# EAGLE board D-DAQ Mainboard (EAGLE 6.6.0)
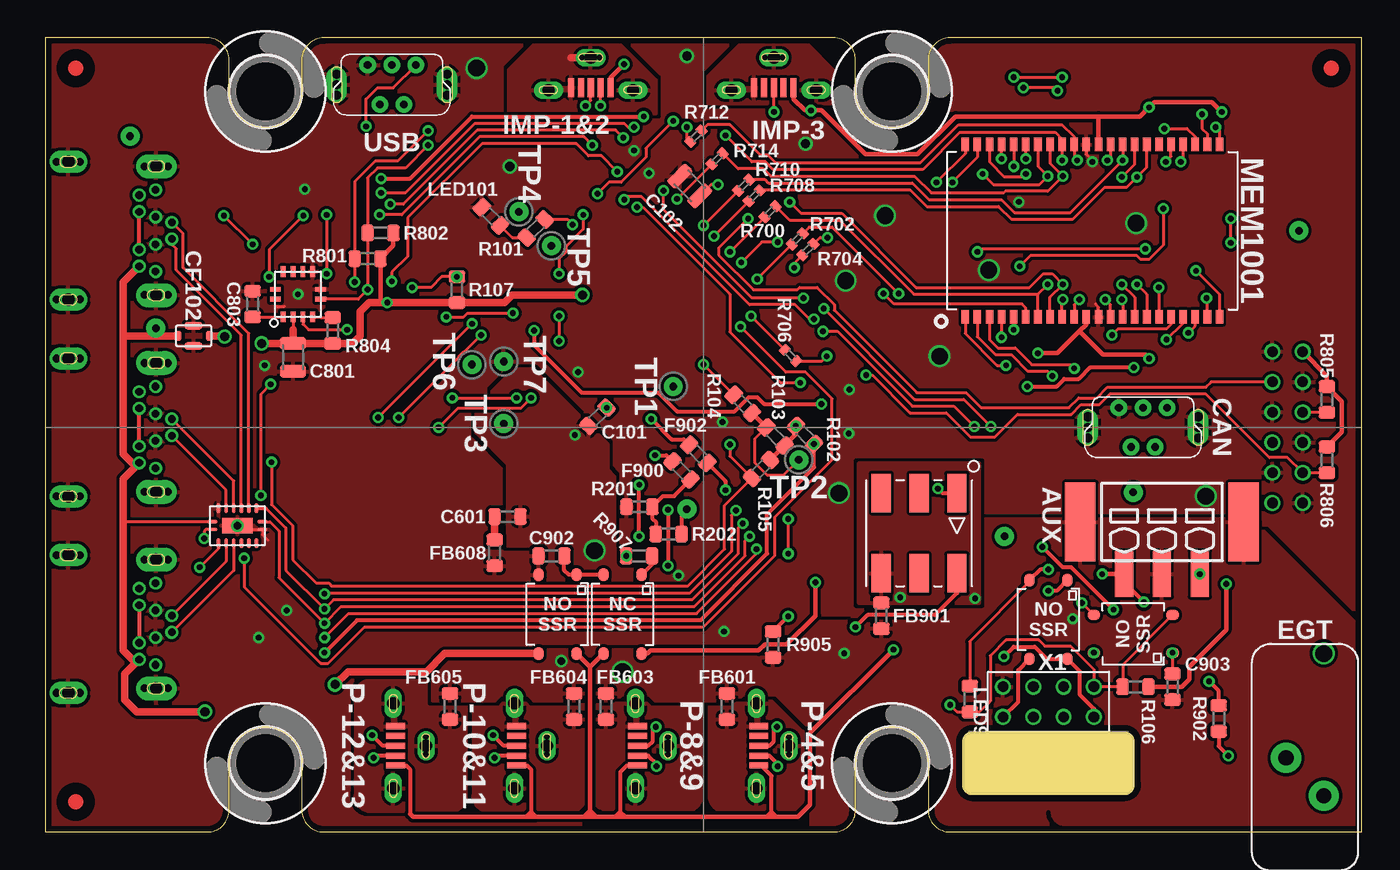
[diagram p1: board, top side]
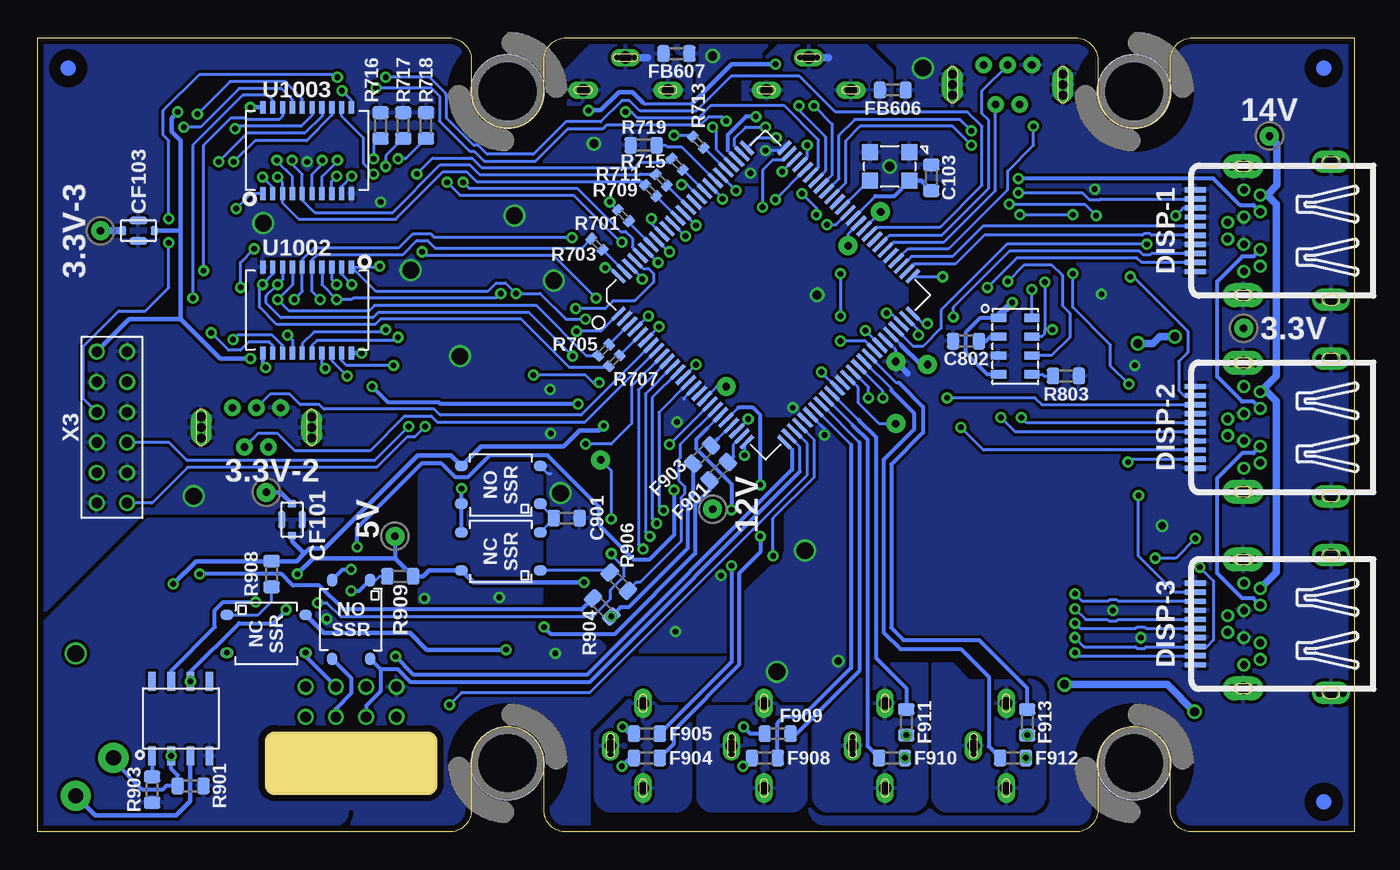
[diagram p2: board, bottom side, seen from below]

Size 87 x 52.5 mm. Coordinates in mm from the lower left corner, seen from the top.
Outline: 71.1,4.55 61.5,4.55
Outline: 0,52.5 0,0 10.7,0 arc90 12.15,1.45 12.15,4.55 arc-90 14.55,6.95 arc-90 16.95,4.55 16.95,1.45 arc90 18.4,0 52.1,0 arc90 53.55,1.45 53.55,4.55 arc-90 55.95,6.95 arc-90 58.35,4.55 58.35,1.45 arc90 59.8,0 87,0 87,52.5 59.8,52.5 arc90 58.35,51.05 58.35,48.95 arc-90 55.95,46.55 arc-90 53.55,48.95 53.55,51.05 arc90 52.1,52.5 18.4,52.5 arc90 16.95,51.05 16.95,48.95 arc-90 14.55,46.55 arc-90 12.15,48.95 12.15,51.05 arc90 10.7,52.5 0,52.5
Outline: 61.25,6 61.25,3.1 71.35,3.1 71.35,6 61.25,6
Copper layers (1*16): Top 0.0355mm / dielectric 1.53mm / Bottom 0.0355mm
Design rules "D-DAQ OSH Park 7x7 *": minimum track width 0.15mm, minimum drill 0.33mm, track to track 0.175mm, track to pad 0.175mm, pad to pad 0.175mm, via to via 0.175mm, smd to smd 0mil, copper to edge 0.4mm, drill to drill 0.15mm, minimum pad ring 0.175mm, minimum via ring 0.175mm, stop-mask expansion 0.075mm, vias tented up to drill 0mil, thermal gap 0.2mm
Net classes: 0 min: width 0.152 mm, drill 0.33 mm, clearance 0.152 mm; 1 analog: width 0.254 mm, drill 0.381 mm, clearance 0.203 mm; 2 digital: width 0.203 mm, drill 0.381 mm, clearance 0.203 mm; 3 power-low: width 0.305 mm, drill 0.381 mm, clearance 0.254 mm; 4 power-med: width 0.508 mm, drill 0.508 mm, clearance 0.254 mm; 5 power-hi: width 0.635 mm, drill 0.635 mm, clearance 0.381 mm
tRestrict: 2 lines
bRestrict: 2 lines

## Footprints (pad centres in the part's own frame; a part is rotated, then mirrored left to right if it is on the bottom)
TP-REC = drill 0.5 pad 1.25: TP 0,0
PC-1771101 = smd 1.2 x 3: P1 -2.5,-2.1; P2 0,-2.1; P3 2.5,-2.1 | smd 2 x 5.2: T0 -5.4,1.35; T1 5.4,1.35
SMD-0603 = smd 0.85 x 1.1: 1 -0.85,0; 2 0.85,0
SMD-0805 = smd 0.8 x 1.7: 1 -0.925,0; 2 0.925,0
USB-MINI-B-VERT = drill 0.5 pad 1.1: 1 1.6,1.3; 2 0.8,-1.3; 3 0,1.3; 4 -0.8,-1.3; 5 -1.6,1.3 | drill 0.6 pad 0.8: P$1 -3.65,0.7; P$2 -3.65,-0.7; P$3 3.65,0.7; P$4 3.65,-0.7 | drill 0.6 pad 1.4 long: T0 3.65,0; T1 -3.65,0
NFM21PS = smd 0.5 x 0.6: 1 -1.05,0; 3 1.05,0 | smd 1.2 x 0.5: 2@1 0,0.675; 2@2 0,-0.675
JAE-MDP-STD = smd 0.35 x 1.4: 1 2.7,6.25; 3 2.1,6.25; 5 1.5,6.25; 7 0.9,6.25; 9 0.3,6.25; 11 -0.3,6.25; 13 -0.9,6.25; 15 -1.5,6.25; 17 -2.1,6.25; 19 -2.7,6.25 | drill 0.5 pad 0.85: 2 2.7,3.042; 8 0.9,3.042; 14 -0.9,3.042 | drill 0.5 pad 0.8: 4 2.35,1.955; 6 1.25,1.955; 10 0.55,4.11; 12 -0.55,4.11; 16 -1.25,1.955; 18 -2.35,1.955; 20 -2.7,3.042 | drill 0.8 pad 1.6 long: BL 4.26,3.09; BR -4.26,3.09 | drill 0.8 pad 1.5 long: FL 4.56,-2.72; FR -4.56,-2.72 | drill 0.5 pad 0.7: P$1 -4.25,3.85; P$2 -4.25,2.3; P$3 4.25,3.85; P$4 4.25,2.3; P$5 -4.55,-1.95; P$6 -4.55,-3.5; P$7 4.55,-1.95; P$8 4.55,-3.5
PC-1702610 = drill 1 pad 2: L 1.25,1.25; R -1.25,-1.25 | drill 1.1 pad 1.4: L1 8.15,-1.25
3.2-GRMT = hole 4.8: 0,0
USB-MICRO-B-VERT = smd 0.4 x 1.25: 1 -1.3,0.9; 2 -0.65,0.9; 3 0,0.9; 4 0.65,0.9; 5 1.3,0.9 | drill 0.381 pad 0.45: P$1 -0.601,-1.1; P$2 0.601,-1.1 | drill 0.8 pad 0.9 long: T0 0,-1.1 | drill 0.8 pad 0.7 long: T1 -2.8,1.05; T2 2.8,1.05
SOP-4-NC = smd 0.7 x 0.85: 1 -1.25,-2.6; 2 1.25,-2.6; 3 1.25,2.6; 4 -1.25,2.6
SOP-4-NO = smd 0.7 x 0.85: 1 -1.25,-2.6; 2 1.25,-2.6; 3 1.25,2.6; 4 -1.25,2.6
TSOP-44 = smd 0.5 x 0.9: 1 -8.4,-5.7; 2 -7.6,-5.7; 3 -6.8,-5.7; 4 -6,-5.7; 5 -5.2,-5.7; 6 -4.4,-5.7; 7 -3.6,-5.7; 8 -2.8,-5.7; 9 -2,-5.7; 10 -1.2,-5.7; 11 -0.4,-5.7; 12 0.4,-5.7; 13 1.2,-5.7; 14 2,-5.7; 15 2.8,-5.7; 16 3.6,-5.7; 17 4.4,-5.7; 18 5.2,-5.7; 19 6,-5.7; 20 6.8,-5.7; 21 7.6,-5.7; 22 8.4,-5.7; 23 8.4,5.7; 24 7.6,5.7; 25 6.8,5.7; 26 6,5.7; 27 5.2,5.7; 28 4.4,5.7; 29 3.6,5.7; 30 2.8,5.7; 31 2,5.7; 32 1.2,5.7; 33 0.4,5.7; 34 -0.4,5.7; 35 -1.2,5.7; 36 -2,5.7; 37 -2.8,5.7; 38 -3.6,5.7; 39 -4.4,5.7; 40 -5.2,5.7; 41 -6,5.7; 42 -6.8,5.7; 43 -7.6,5.7; 44 -8.4,5.7
SMD-0402 = smd 0.55 x 0.7: 1 -0.525,0; 2 0.525,0
TQFP-100-14X14 = smd 1.15 x 0.254: 1 -7.75,6; 25 -7.75,-6; 51 7.75,-6; 75 7.75,6 | smd 1.25 x 0.254: 2 -7.7,5.5; 3 -7.7,5; 4 -7.7,4.5; 5 -7.7,4; 6 -7.7,3.5; 7 -7.7,3; 8 -7.7,2.5; 9 -7.7,2; 10 -7.7,1.5; 11 -7.7,1; 12 -7.7,0.5; 13 -7.7,0; 14 -7.7,-0.5; 15 -7.7,-1; 16 -7.7,-1.5; 17 -7.7,-2; 18 -7.7,-2.5; 19 -7.7,-3; 20 -7.7,-3.5; 21 -7.7,-4; 22 -7.7,-4.5; 23 -7.7,-5; 24 -7.7,-5.5; 52 7.7,-5.5; 53 7.7,-5; 54 7.7,-4.5; 55 7.7,-4; 56 7.7,-3.5; 57 7.7,-3; 58 7.7,-2.5; 59 7.7,-2; 60 7.7,-1.5; 61 7.7,-1; 62 7.7,-0.5; 63 7.7,0; 64 7.7,0.5; 65 7.7,1; 66 7.7,1.5; 67 7.7,2; 68 7.7,2.5; 69 7.7,3; 70 7.7,3.5; 71 7.7,4; 72 7.7,4.5; 73 7.7,5; 74 7.7,5.5 | smd 0.254 x 1.15: 26 -6,-7.75; 50 6,-7.75; 76 6,7.75; 100 -6,7.75 | smd 0.254 x 1.25: 27 -5.5,-7.7; 28 -5,-7.7; 29 -4.5,-7.7; 30 -4,-7.7; 31 -3.5,-7.7; 32 -3,-7.7; 33 -2.5,-7.7; 34 -2,-7.7; 35 -1.5,-7.7; 36 -1,-7.7; 37 -0.5,-7.7; 38 0,-7.7; 39 0.5,-7.7; 40 1,-7.7; 41 1.5,-7.7; 42 2,-7.7; 43 2.5,-7.7; 44 3,-7.7; 45 3.5,-7.7; 46 4,-7.7; 47 4.5,-7.7; 48 5,-7.7; 49 5.5,-7.7; 77 5.5,7.7; 78 5,7.7; 79 4.5,7.7; 80 4,7.7; 81 3.5,7.7; 82 3,7.7; 83 2.5,7.7; 84 2,7.7; 85 1.5,7.7; 86 1,7.7; 87 0.5,7.7; 88 0,7.7; 89 -0.5,7.7; 90 -1,7.7; 91 -1.5,7.7; 92 -2,7.7; 93 -2.5,7.7; 94 -3,7.7; 95 -3.5,7.7; 96 -4,7.7; 97 -4.5,7.7; 98 -5,7.7; 99 -5.5,7.7
TSSOP-20 = smd 0.35 x 0.85: 1 -2.925,-2.85; 2 -2.275,-2.85; 3 -1.625,-2.85; 4 -0.975,-2.85; 5 -0.325,-2.85; 6 0.325,-2.85; 7 0.975,-2.85; 8 1.625,-2.85; 9 2.275,-2.85; 10 2.925,-2.85; 11 2.925,2.85; 12 2.275,2.85; 13 1.625,2.85; 14 0.975,2.85; 15 0.325,2.85; 16 -0.325,2.85; 17 -0.975,2.85; 18 -1.625,2.85; 19 -2.275,2.85; 20 -2.925,2.85
LGA-8 = smd 1 x 0.55: 1 -1.1,1.9; 2 -1.1,0.65; 3 -1.1,-0.6; 4 -1.1,-1.85; 5 1.1,-1.85; 6 1.1,-0.6; 7 1.1,0.65; 8 1.1,1.9
LEADLESS-SMT = smd 2.54 x 1.27: 1 -2.65,2.5; 2 -2.65,0; 3 -2.65,-2.5; 4 2.65,-2.5; 5 2.65,0; 6 2.65,2.5
QFN-12 = smd 0.71 x 0.325: 1 -1.5,0.975; 2 -1.5,0.325; 3 -1.5,-0.325; 4 -1.5,-0.975; 7 1.5,-0.975; 8 1.5,-0.325; 9 1.5,0.325; 10 1.5,0.975 | smd 0.325 x 0.71: 5 -0.325,-1.5; 6 0.325,-1.5; 11 0.325,1.5; 12 -0.325,1.5
SOT-8 = smd 0.5 x 1.25: 1 -1.905,-2.465; 2 -0.635,-2.465; 3 0.635,-2.465; 4 1.905,-2.465; 5 1.905,2.465; 6 0.635,2.465; 7 -0.635,2.465; 8 -1.905,2.465
DHVQFN16 = smd 0.65 x 0.25: -CE 1.15,1.25; -Q7 -1.15,-1.25; CP -1.15,1.25; D0 1.15,-0.75; D1 1.15,-0.25; D2 1.15,0.25; D3 1.15,0.75; D4 -1.15,0.75; D5 -1.15,0.25; D6 -1.15,-0.25; D7 -1.15,-0.75; DS 1.15,-1.25 | smd 0.25 x 0.65: -PL -0.25,1.65; GND -0.25,-1.65; Q7 0.25,-1.65; VCC 0.25,1.65 | smd 1 x 2: GND2 0,0
MOLEX-87760-0816 = drill 0.7: 1 -3,-1; 2 -1,-1; 3 1,-1; 4 3,-1; 5 3,1; 6 1,1; 7 -1,1; 8 -3,1
MOLEX-87760-1216 = drill 0.7: 1 -5,-1; 2 -3,-1; 3 -1,-1; 4 1,-1; 5 3,-1; 6 5,-1; 7 5,1; 8 3,1; 9 1,1; 10 -1,1; 11 -3,1; 12 -5,1
3.2X2.5MM = smd 1.05 x 1.05: P$1 -1.3,-0.95; P$2 1.3,-0.95; P$3 1.3,0.95; P$4 -1.3,0.95

## Placement (x,y rotation side)
3.3V  TP-0463  [TP-REC]  7.3,33.3 0 bottom
3.3V-2  TP-0463  [TP-REC]  71.9,22.45 0 bottom
3.3V-3  TP-0463  [TP-REC]  82.85,39.75 0 bottom
5V  TP-0463  [TP-REC]  63.4,19.55 0 bottom
12V  TP-0463  [TP-REC]  42.4,21.35 0 bottom
14V  TP-0463  [TP-REC]  5.6,46 0 bottom
AUX  PC-3-1771101  [PC-1771101]  73.8,19.15 0 top
BFID-1  [1MM-FIDUCIAL]  2,2 0 bottom
BFID-2  [1MM-FIDUCIAL]  2,50.5 0 bottom
BFID-3  [1MM-FIDUCIAL]  85,50.5 0 bottom
C101  0.1uF  [SMD-0603]  36.5,27.45 225 top
C102  10uF  [SMD-0805]  42.6,42.7 135 top
C103  10nF  [SMD-0603]  27.95,43.25 90 bottom
C601  0.1uF  [SMD-0603]  30.55,20.85 180 top
C801  10uF  [SMD-0805]  16.38,31.38 270 top
C802  0.1uF  [SMD-0603]  25.65,32.45 0 bottom
C803  0.1uF  [SMD-0603]  13.7,34.9 90 top
C901  4.7uF  [SMD-0603]  52.05,20.75 180 bottom
C902  4.7uF  [SMD-0603]  33.45,18.25 0 top
C903  4.7uF  [SMD-0603]  74.5,9.6 270 top
CAN  UE25BE5510H  [USB-MINI-B-VERT]  72.55,26.75 0 top
CF101  [NFM21PS]  70.2,20.65 270 bottom
CF102  [NFM21PS]  9.8,32.8 0 top
CF103  [NFM21PS]  80.35,39.75 0 bottom
DISP-1  Standard  [JAE-MDP-STD]  4.25,39.75 90 bottom
DISP-2  Standard  [JAE-MDP-STD]  4.25,26.75 90 bottom
DISP-3  Standard  [JAE-MDP-STD]  4.25,13.75 90 bottom
EGT  [PC-1702610]  83.25,3.65 90 top
F900  470  [SMD-0603]  42.05,23.9 135 top
F901  470  [SMD-0603]  42,23.85 45 bottom
F902  470  [SMD-0603]  43.15,25 135 top
F903  470  [SMD-0603]  43.1,24.95 45 bottom
F904  470  [SMD-0603]  46.75,4.9 180 bottom
F905  470  [SMD-0603]  46.75,6.5 180 bottom
F908  470  [SMD-0603]  38.95,4.9 0 bottom
F909  470  [SMD-0603]  38.1,6.5 0 bottom
F910  470  [SMD-0603]  30.55,4.9 180 bottom
F911  470  [SMD-0603]  29.6,7.25 90 bottom
F912  470  [SMD-0603]  22.55,4.9 180 bottom
F913  470  [SMD-0603]  21.6,7.25 90 bottom
FB601  470  [SMD-0603]  45.05,8.3 90 top
FB603  470  [SMD-0603]  37.05,8.3 90 top
FB604  470  [SMD-0603]  34.95,8.3 90 top
FB605  470  [SMD-0603]  26.75,8.3 90 top
FB606  470  [SMD-0603]  30.5,49.05 0 bottom
FB607  470  [SMD-0603]  44.8,51.45 0 bottom
FB608  470  [SMD-0603]  29.7,18.45 90 top
FB901  470  [SMD-0603]  55.25,14.3 270 top
HOLE-BL  [3.2-GRMT]  14.55,48.95 0 top
HOLE-BR  [3.2-GRMT]  14.55,4.55 0 top
HOLE-ML  [3.2-GRMT]  55.95,48.95 0 top
HOLE-MR  [3.2-GRMT]  55.95,4.55 0 top
IMP-1&2  Micro USB  [USB-MICRO-B-VERT]  36.05,50.1 180 top
IMP-3  Micro USB  [USB-MICRO-B-VERT]  48.15,50.1 180 top
K1001  NC SSR  [SOP-4-NC]  56.4,18.55 90 bottom
K1002  NO SSR  [SOP-4-NO]  56.4,22.95 90 bottom
K1003  NC SSR  [SOP-4-NC]  38.15,14.4 180 top
K1004  NO SSR  [SOP-4-NO]  33.85,14.4 180 top
K1005  NC SSR  [SOP-4-NC]  71.9,13.1 270 bottom
K1006  NO SSR  [SOP-4-NO]  71.9,13.1 90 top
K1007  NO SSR  [SOP-4-NO]  66.3,14.05 180 top
K1008  NO SSR  [SOP-4-NO]  66.3,14.05 180 bottom
LED101  Yellow  [SMD-0603]  29.45,40.7 135 top
LED901  Red  [SMD-0603]  61.1,8.8 270 top
MEM1001  IS61WV25616ALL  [TSOP-44]  69.2,39.75 0 top
OSHW-BOT  [OSHW-LOGO-L]  6.5,4.55 90 bottom
OSHW-TOP  [OSHW-LOGO-L]  38.9,35.5 270 top
P-4&5  Micro USB  [USB-MICRO-B-VERT]  48.05,5.7 90 top
P-8&9  Micro USB  [USB-MICRO-B-VERT]  40.05,5.7 90 top
P-10&11  Micro USB  [USB-MICRO-B-VERT]  32.05,5.7 90 top
P-12&13  Micro USB  [USB-MICRO-B-VERT]  24.05,5.7 90 top
R101  10k  [SMD-0603]  32.4,39.9 225 top
R102  10k  [SMD-0603]  50.2,26.25 315 top
R103  10k  [SMD-0603]  48.25,26.15 135 top
R104  470  [SMD-0603]  46.1,28.3 135 top
R105  10k  [SMD-0603]  47.3,24 225 top
R106  10k  [SMD-0603]  72.05,9.6 180 top
R107  10k  [SMD-0603]  27.2,35.85 270 top
R201  1.4k  [SMD-0603]  39.26,21.5 0 top
R202  10k  [SMD-0603]  41.2,19.7 180 top
R700  140  [SMD-0402]  47.9,41 45 top
R701  140  [SMD-0402]  48.3,40.75 135 bottom
R702  140  [SMD-0402]  49.7,39.2 45 top
R703  140  [SMD-0402]  50.05,38.85 135 bottom
R704  140  [SMD-0402]  50.4,38.5 45 top
R705  140  [SMD-0402]  49.6,31.85 225 bottom
R706  140  [SMD-0402]  49.25,31.5 315 top
R707  140  [SMD-0402]  48.9,31.15 225 bottom
R708  140  [SMD-0402]  46.85,42.05 45 top
R709  140  [SMD-0402]  46.5,42.4 135 bottom
R710  140  [SMD-0402]  46.15,42.75 45 top
R711  140  [SMD-0402]  45.8,43.1 135 bottom
R712  140  [SMD-0402]  43,46 45 top
R713  140  [SMD-0402]  43.35,45.6 135 bottom
R714  140  [SMD-0402]  44.4,44.5 45 top
R715  140  [SMD-0402]  44.75,44.15 135 bottom
R716  10k  [SMD-0603]  64.35,46.7 90 bottom
R717  10k  [SMD-0603]  62.85,46.7 90 bottom
R718  10k  [SMD-0603]  61.35,46.7 90 bottom
R719  10k  [SMD-0603]  46.96,45.4 180 bottom
R801  1.4k  [SMD-0603]  21.3,37.9 180 top
R802  1.4k  [SMD-0603]  22.15,39.6 180 top
R803  10k  [SMD-0603]  19.05,30.15 180 bottom
R804  10k  [SMD-0603]  19,33.15 90 top
R805  10k  [SMD-0603]  84.7,28.6 270 top
R806  10k  [SMD-0603]  84.7,24.6 270 top
R901  1.4k  [SMD-0603]  76.9,3.05 180 bottom
R902  100k  [SMD-0603]  77.55,7.5 90 top
R903  10k  [SMD-0603]  79.45,2.8 270 bottom
R904  255  [SMD-0603]  49.7,14.85 315 bottom
R905  10k  [SMD-0603]  48.1,12.4 270 top
R906  100  [SMD-0603]  48.6,16.55 135 bottom
R907  100  [SMD-0603]  39.25,18.25 0 top
R908  100  [SMD-0603]  71.55,17.05 270 bottom
R909  100  [SMD-0603]  63.05,16.9 180 bottom
TFID-1  [1MM-FIDUCIAL]  2,2 0 top
TFID-2  [1MM-FIDUCIAL]  2,50.5 0 top
TFID-3  [1MM-FIDUCIAL]  85,50.5 0 top
TP1  TP-0463  [TP-REC]  41.5,29.45 0 top
TP2  TP-0463  [TP-REC]  49.8,24.6 0 top
TP3  TP-0463  [TP-REC]  30.3,27 0 top
TP4  TP-0463  [TP-REC]  31.3,41 0 top
TP5  TP-0463  [TP-REC]  33.45,38.75 0 top
TP6  TP-0463  [TP-REC]  28.2,30.9 0 top
TP7  TP-0463  [TP-REC]  30.3,31.1 0 top
U1001  795F512L-80V/PT  [TQFP-100-14X14]  38.9,35.5 45 bottom
U1002  Octal D-Latch  [TSSOP-20]  69.2,34.5 180 bottom
U1003  Octal D-Latch  [TSSOP-20]  69.2,45.05 0 bottom
U1004  Baro & Temp  [LGA-8]  22.4,32.1 0 bottom
U1005  Boost  [LEADLESS-SMT]  57.75,19.75 270 top
U1006  Accelerometer  [QFN-12]  16.7,35.55 90 top
U1007  MAX4239  [SOT-8]  77.55,7.5 0 bottom
U1008  NXP-74HC165  [DHVQFN16]  12.7,20.25 90 top
USB  UE25BE5510H  [USB-MINI-B-VERT]  22.9,49.4 0 top
X1  [MOLEX-87760-0816]  66.3,8.6 0 top
X3  MOLEX-87760-1216"  [MOLEX-87760-1216]  82.1,26.75 90 bottom
Y1001  XTC7009  [3.2X2.5MM]  30.7,44 180 bottom

## Tracks (layer width: path | path; a pad name or v marks a point on that pad's centre or on a via)
3.3V-RAIL-1
  Bottom 0.305: 3.3V-2.TP 70.95,22.45 CF101.1
3.3V-RAIL-2  (via drill 0.6)
  Top 0.203: U1008.VCC 5.15,20.5
  Top 0.508: K1004.3 26.4,11.8 25.2,10.6 20,10.6 v19.15,9.75 | DISP-1.18 5.15,36.34 5.15,32.8 | 5.15,32.8 5.15,25 5.75,24.4 DISP-2.18 5.15,23.34 5.15,20.5 5.15,12 5.75,11.4 DISP-3.18 5.25,10.45 5.25,8.75 6.05,7.95 v10.55,7.95 | 7.3,32.8 5.15,32.8 | 3.3V.TP 7.3,32.8 | CF102.1 7.3,32.8
  Bottom 0.508: v19.15,9.75 12.35,9.75 v10.55,7.95
3.3V-RAIL-3
  Bottom 0.508: 3.3V-3.TP CF103.1
5V-RAIL  (via drill 0.38)
  Top 0.254: v72.6,15.2 71.3,16.5 AUX.P1
  Top 0.305: K1003.4 39.8,11.8 40,12 47.15,12 47.55,12.4 49,12.4 50.9,14.3 v50.9,16.5 | v69.85,17.05 AUX.P1
  Bottom 0.254: U1007.7 78.19,10.66 75.3,13.55 75.3,14.65 74.75,15.2 v72.6,15.2 | 5V.TP 63.4,18.1
  Bottom 0.305: v50.9,16.5 58.2,16.5 K1001.4 61.15,17.3 61.55,16.9 R909.1 63.4,18.1 68.8,18.1 v69.85,17.05
6&7-PIN-1  (via drill 0.38)
  Bottom 0.254: X1.6 69.3,11.6 K1006.4
  other vias: 69.3,11.85
12V-INPUT
  Top 0.254: 12V.TP 42.05,21 R202.1
14V-RAIL
  Bottom 0.508: 5.75,42.1 5.15,41.5 5.15,30.16 DISP-2.4 5.75,29.1 5.15,28.5 5.15,17.16 DISP-3.4 | 14V.TP 5.1,45.5 5.1,42.75 5.75,42.1 | DISP-1.4 5.75,42.1
ACCEL-BYP
  Top 0.203: C803.1 U1006.1
ACCEL-EN
  Top 0.203: U1006.4 18.15,34.05 18.2,34 R804.2
ADT-1
  Bottom 0.203: R906.2 49.35,17.3 K1001.1
ADT-2
  Top 0.203: 40.1,17.7 R907.2
  Top 0.254: K1003.1 40.1,17.7
ADT-3
  Bottom 0.203: K1005.1 72.45,14.35 71.55,15.25 R908.2
ADT-4  (via drill 0.38)
  Top 0.254: K1007.1 66.85,15.95 v66.3,15.95
  Bottom 0.203: K1008.1 64.65,16.65 64.4,16.9 R909.2
  Bottom 0.254: v66.3,15.95 65.75,15.95 K1008.1
AGND  (via drill 0.38, 0.5, 1.1)
  Bottom 0.203: U1001.31 35,26.65 v35,26.25
  other vias: 38.15,10.6 36.3,18.6 34.1,11.3 67.9,14.1 52.8,11.8
  pour Bottom (rank 3): 32.7,12 32.7,11.4 26.9,11.4 25.6,10.1 25.6,8.7 29.7,8.7 30.1,9.1 31.9,9.1 32.3,8.7 37.7,8.7 38.1,9.1 39.9,9.1 40.3,8.7 45.7,8.7 46.1,9.1 48.3,9.1 50.6,6.8 50.6,0.5 86.5,0.5 86.5,13.9 79.75,20.65 62.1,20.65 62.1,16.9 59.1,13.9 51.2,13.9 48.8,11.5 40.3,11.5 40.3,12
  pour Bottom (rank 3): 33.7,25.35 35.5,27.2 35.5,26.3 35.3,26.1 35.3,23.25 37.6,20.95 37.6,18.45 39.15,16.9 40.2,15.9 40.2,11.7 33.7,11.7
  pour Top (rank 3): 30.6,24.3 28.5,26.4 28.5,28.1 31,30.6 32.2,30.6 37.15,25.65 37.15,23.95 37.6,23.5 37.6,18.8 38.75,17.6 38.75,16.65 33.15,16.65 33.15,18.9 30.6,18.9
  pour Top (rank 3): 32.7,12 32.7,11.4 26.9,11.4 25.6,10.1 25.6,8.7 29.7,8.7 30.1,9.1 31.9,9.1 32.3,8.7 37.7,8.7 38.1,9.1 39.9,9.1 40.3,8.7 45.7,8.7 46.1,9.1 48.3,9.1 50.6,6.8 50.6,0.5 86.5,0.5 86.5,13.9 79.75,20.65 62.1,20.65 62.1,16.9 59.1,13.9 51.2,13.9 48.8,11.5 40.3,11.5 40.3,12
ALT-INT  (via drill 0.38)
  Top 0.203: v37.8,43.65 36.75,44.7 35.9,44.7 35.1,45.5 28.85,45.5 23.95,40.6 23.95,38.05 22.9,37 v22.9,36.4
  Bottom 0.203: U1004.6 20,31.5 18.8,32.7 18.8,34.3 19.3,34.8 19.3,36.8 20,37.5 21.8,37.5 v22.9,36.4 | U1001.73 37.8,43.67 v37.8,43.65
AN0-VOLT  (via drill 0.38)
  Top 0.254: v40.3,24.9 41.05,24.9 F900.2
  Bottom 0.203: U1001.25 40.3,25.61 v40.3,24.9
AN1-BOOST
  Bottom 0.203: U1001.24 41.05,25.57 41.05,24.8
  Bottom 0.254: 41.05,24.8 F901.2
AN2-EGT  (via drill 0.38)
  Top 0.254: v40.05,27.3 | v40.05,27.3 41.4,25.95 42.2,25.95 F902.2
  Bottom 0.203: U1001.23 40.05,27.28 v40.05,27.3
AN3-AUX-PRESS
  Bottom 0.203: U1001.22 42.04,26 42.05,26
  Bottom 0.254: 42.05,26 F903.2
AN4  (via drill 0.38)
  Top 0.254: P-4&5.2 47.85,5.05 48.4,4.5 v48.4,4.35
  Bottom 0.254: v48.4,4.35 47.85,4.9 F904.2
AN5  (via drill 0.38)
  Top 0.254: P-4&5.3 47.85,5.7 48.15,6 48.15,6.75 v48.35,6.95
  Bottom 0.254: v48.35,6.95 47.9,6.5 F905.2
AN8  (via drill 0.38)
  Top 0.254: P-8&9.2 39.85,5.05 40.4,4.5 v40.4,4.35
  Bottom 0.254: v40.4,4.35 39.85,4.9 F908.1
AN9  (via drill 0.38)
  Top 0.254: P-8&9.3 39.85,5.7 40.15,6 40.15,6.75 v40.35,6.95
  Bottom 0.254: v40.35,6.95 39.9,6.5 F909.1
AN10  (via drill 0.38)
  Top 0.254: P-10&11.2 29.85,5.05 F910.1
  other vias: 29.7,4.9
AN11  (via drill 0.38)
  Top 0.254: P-10&11.3 30.3,5.7 F911.1
  other vias: 29.6,6.4
AN12  (via drill 0.38)
  Top 0.254: P-12&13.2 21.85,5.05 F912.1
  other vias: 21.7,4.9
AN13  (via drill 0.38)
  Top 0.254: P-12&13.3 22.3,5.7 F913.1
  other vias: 21.6,6.4
AUX-OUT  (via drill 0.38)
  Top 0.254: R905.1 | R905.1 R904.2
  Bottom 0.254: R904.2 48.5,14.85 47.95,14.85 44.05,18.75 44.05,21.9 43.7,22.25 F903.1
  other vias: 49.1,14.25
BARO-INT
  Bottom 0.203: U1004.5 20.6,30.25 20.5,30.15 R803.2
BOOST-GND  (via drill 0.38)
  other vias: 56.5,15.5 61.45,15.45
  pour Top: 53.75,24.35 53.75,15.15 61.75,15.15 61.75,24.35
  pour Bottom: 53.75,24.35 53.75,15.15 61.75,15.15 61.75,24.35
BOOST-OUT  (via drill 0.38)
  Top 0.254: U1005.6 60.25,15.8 58.8,14.35 54.35,14.35 v53.55,13.55
  Bottom 0.254: v53.55,13.55 53.1,13.1 48.85,13.1 43.55,18.4 43.55,21.65 42.6,22.6 F901.1
BOOST-PWR  (via drill 0.38)
  Top 0.254: v59,22.7 59.3,22.4 U1005.1
  Bottom 0.254: v59,22.7 K1002.4 K1001.3
BOOST-SSR
  Bottom 0.203: K1002.1 52.9,20.8 C901.2 52.9,20.7 K1001.2
BOOST-V-TOGGLE
  Bottom 0.203: U1001.19 44.55,25.61 44.55,24.75 44.65,24.65 44.65,23.25 44.25,22.85 44.25,22.35 44.5,22.1 44.5,19.2 47.2,16.5 47.45,16.5 R906.1
CAN-BUS-1
  Bottom 0.203: CAN.2 72.45,26.35 71.15,26.35 70,25.2 65.05,25.2 62.75,27.5 61,27.5 60.6,27.1 50.84,27.1 U1001.8
CAN-BUS-2
  Bottom 0.203: U1001.7 51.09,27.55 60.4,27.55 60.8,27.95 68.1,27.95 68.4,28.25 69.65,28.25 70.35,28.95 71.65,28.95 CAN.3
CLEAN-3.3V-1  (via drill 0.38)
  Top 0.305: R106.1 75.1,9.6 75.6,10.1 75.6,10.9 78.05,13.35 v78.05,16.4 | R103.1 | R102.1 49.6,26.3 R103.1 | R105.1 R103.1
  Bottom 0.305: R102.1 | R102.1 49.9,26.55 51.2,26.55 52.25,25.5 57.7,25.5 K1002.3 59.7,24.9 61.9,24.9 68.05,18.75 69.05,18.75 69.4,18.4 | 69.4,18.4 69.9,17.9 R908.1 76.55,17.9 v78.05,16.4 | CF101.3 70.2,19.2 69.4,18.4
  other vias: 49.6,26.85
CLEAN-3.3V-2  (via drill 0.38, 0.6)
  Top 0.203: U1006.2 16.38,33.23
  Top 0.305: R802.1 23,38.75 R801.1 22.15,35
  Top 0.508: v11.85,32.75 11.8,32.8 CF102.3 | v14.3,32.3 C801.1 | 16.38,33.23 C801.1 | C801.1 R804.1 20.3,32.3 20.8,32.8 20.8,34.4 21.4,35 22.15,35 v22.6,35 R107.2 30.35,35 30.85,35.5 v35.5,35.5
  Bottom 0.203: U1001.62 31.64,42.05 | U1001.46 29.95,32.21
  Bottom 0.254: 31.64,42.05 30.4,42.05 Y1001.P$4 | U1004.4 24.25,30.25 25.65,31.65 25.65,33.05 24.7,34 U1004.1
  Bottom 0.305: C103.1 28.6,43.05 Y1001.P$4 | 28.6,30.9 TP6.TP 28.65,30.9 29.95,32.2 29.95,32.21
  Bottom 0.508: v11.85,32.75 12.85,32.75 13.3,32.3 v14.3,32.3 | U1004.1 23.5,34.1 v22.6,35
  other vias: 37.1,28.05
  pour Bottom (isolate 0.203, no thermals): 47.8,34.3 41.02,27.52 36.78,27.52 29.52,34.78 29.52,36.22 35.86,42.56 41.94,42.56 47.8,36.7
CLEAN-3.3V-3  (via drill 0.38)
  Top 0.305: v65.6,31.65 66.9,31.65 68.35,33.1 | 68.35,33.1 68.8,33.55 MEM1001.11 | v77.75,47.6 77.1,48.25 73.3,48.25 v72.95,47.9 72.35,47.3 69.6,47.3 | 68.35,33.1 69.9,31.55 72.7,31.55 v72.95,31.3 | IMP-1&2.1 37.35,49.85 v38.25,50.75 | 49.45,49.55 IMP-3.1 49.45,48.45 50.2,47.7 v50.6,47.7 | v50.6,47.7 51.3,47.7 54.2,44.8 57.65,44.8 60.15,47.3 69.6,47.3 | v50.6,47.7 50.65,47.7 | MEM1001.33 69.6,47.3 | R806.1 85.7,26.45 85.7,28.45 R805.1 84.7,30.15 X3.7
  Bottom 0.203: 43.7,48.2 43.8,48.1 46.9,48.1 47,48.2
  Bottom 0.305: U1003.20 v72.95,47.9 | v77.75,47.6 78.15,47.2 78.15,46.3 77.55,45.7 77.55,39.75 | U1002.20 v65.6,31.65 | v38.25,50.75 41.15,50.75 43.7,48.2 | 47,48.2 47.7,48.9 48.6,48.9 49.8,47.7 v50.6,47.7 | v72.95,31.3 74.95,31.3 77.55,33.9 | CF103.3 77.55,39.75 | 77.55,39.75 77.55,33.9 | 77.55,33.9 80.95,33.9 X3.7
DGND  (via drill 0.38, 0.5, 0.6, 1.1)
  Top 0.203: MEM1001.34 68.8,44.8 69.2,44.4 v69.2,44.3 | 15.3,34.75 15.8,34.75 | 14.7,19.3 14.35,19.65 U1008.GND 12.95,20 U1008.GND2 | MEM1001.12 69.6,34.7 69.4,34.9
  Bottom 0.203: TP7.TP 30.3,31.85 U1001.45 | K1002.2 53.3,23.7 53.1,23.7 | U1001.15 44.3,28.69 44.3,28.6 | U1001.36 35.2,30.39 v35.2,30.4 | U1001.75 37.84,45.05 v38.9,45.05
  Bottom 0.406: TP7.TP 29.5,30.3
  other vias: 12.7,20.25 39.9,43.55 30.7,44 28.5,50.5 72.1,40.25 55.5,40.75 52.9,36.45 59.1,31.45 76.7,22.2 44.75,27.1 42.4,51.3 50.25,45.5 16.7,35.55 14.5,30.85 52.45,22.4 15.95,14.65 14.1,12.85 64.35,41.65 62.35,37.15 41.85,16.95 44.85,13.25 17.15,42.5 53.15,29.25 53.1,26.35
  pour Bottom (rank 5): 0.5,52 86.5,52 86.5,0.5 0.5,0.5
  pour Top (rank 5): 0.5,52 86.5,52 86.5,0.5 0.5,0.5
DISP1-B1
  Bottom 0.203: U1001.52 29.07,37.55 26.35,37.55 24.45,39.45 14,39.45 13.9,39.55 13.5,39.55 13.4,39.45 DISP-1.11
DISP1-B2
  Top 0.203: U1008.D1 12.95,32.85 8.65,37.15 8.65,38.55 8.36,38.84 DISP-1.12
DISP1-B3
  Top 0.203: U1008.D0 13.45,32.95 9.1,37.3 9.1,39.56 DISP-1.10
DISP1-HPD  (via drill 0.38)
  Top 0.203: R107.1 26.2,36.7 25.5,36 v24.25,36
  Bottom 0.203: DISP-1.17 14.05,37.65 14.35,37.95 22.3,37.95 v24.25,36 | U1001.51 29.14,36.7 R107.1
  other vias: 27.2,36.7
DISP1-RS  (via drill 0.38)
  Top 0.203: v13.7,38.85 v11.8,40.75
  Bottom 0.203: U1001.47 29.14,32.1 28.5,32.1 27.3,33.3 27.3,34.5 22.95,38.85 v13.7,38.85 | DISP-1.5 11.3,41.25 v11.8,40.75
DISP2-B1  (via drill 0.38)
  Top 0.203: v23.35,27.4 27.35,31.4 27.35,31.45 27.65,31.75 27.7,31.75 v28.8,32.85
  Bottom 0.203: U1001.49 28.8,33.18 v28.8,32.85 | DISP-2.11 22.4,26.45 v23.35,27.4
DISP2-B2
  Top 0.203: U1008.D3 11.95,22.61 DISP-2.12
DISP2-B3
  Top 0.203: U1008.D2 12.45,23.21 DISP-2.10
DISP2-HPD  (via drill 0.38)
  Top 0.203: v45.25,25.61 45.25,24.85 R105.2 44.9,21.6 44.9,18.7 42.45,16.25 18.95,16.25 18.75,16.45 17.9,16.45 16.35,18 16.35,20.25 14.95,21.65 v14.95,24.45
  Bottom 0.203: DISP-2.17 14.75,24.65 v14.95,24.45 | U1001.18 v45.25,25.61
DISP2-RS  (via drill 0.38)
  Top 0.203: v26.9,28.7 v31.15,28.7
  Bottom 0.203: v31.15,28.7 31.15,29.16 U1001.40 | v26.9,28.7 21.1,28.7 20.65,28.25 DISP-2.5
DISP3-B1  (via drill 0.38)
  Top 0.203: v46.55,19.55 46.25,19.25 46.25,18.25 42.9,14.9 19.55,14.9 v18.45,13.8 15.45,16.8 15.45,19.9 14.85,20.5 U1008.Q7
  Bottom 0.203: U1001.11 46.85,28.96 46.85,19.85 v46.55,19.55 | DISP-3.11 13.75,13.45 13.85,13.55 14.35,13.55 14.45,13.45 18.1,13.45 v18.45,13.8
DISP3-B2
  Top 0.203: U1008.D5 12.45,17.29 DISP-3.12
DISP3-B3
  Top 0.203: U1008.D4 11.95,17.89 DISP-3.10
DISP3-HPD  (via drill 0.38)
  Top 0.254: v18.45,11.85 20.6,14 43.3,14 47.7,18.4 47.7,21 50.8,24.1 R102.2
  Bottom 0.203: v18.45,11.85 18.25,11.65 DISP-3.17 | U1001.9 47.75,29.48 47.75,27 49.1,25.65 R102.2
  other vias: 50.8,25.65
DISP3-RS  (via drill 0.38)
  Top 0.203: v45.65,21.25 45.35,20.95 45.35,18.55 42.6,15.8 18.5,15.8 v18.45,15.75
  Bottom 0.203: U1001.14 45.95,27.74 45.95,21.55 v45.65,21.25 | DISP-3.5 15.6,15.25 15.7,15.35 16.15,15.35 16.25,15.25 17.95,15.25 v18.45,15.75
EGT-NEG-IN  (via drill 0.38)
  Top 0.254: R902.1 77.55,5.67 U1007.2
  Bottom 0.254: EGT.L 82,4.7 80.1,2.8 78.75,2.8 78.5,3.05 R901.2 77.75,3.75 78.19,4.18 U1007.2
  other vias: 78.19,5.04
EGT-OUT  (via drill 0.38)
  Top 0.254: v44.95,22.6 44.95,23.2 F902.1 | R902.2 77.55,9.33 v76.92,9.96 | v70.6,14.7 67.8,17.5 67.25,17.5 v65.9,18.85
  Bottom 0.254: v76.92,9.96 76.92,10.59 73.7,13.8 71.45,13.8 70.6,14.65 v70.6,14.7 | v65.9,18.85 65.9,20.1 61.65,24.35 60.3,24.35 59.4,23.45 58.6,23.45 57.15,24.9 53.3,24.9 49.9,21.5 49.9,20.3 47.6,18 46.6,18 44.95,19.65 v44.95,22.6
EGT-POS-IN
  Bottom 0.305: U1007.3 76.92,2.04 77.85,1.1 83.2,1.1 EGT.R
EGT-SHDN
  Bottom 0.254: U1007.1 R903.1
GND-FILTER
  Top 0.508: C601.2 FB608.2
HB-PD  (via drill 0.38)
  Top 0.203: MEM1001.40 v64,44
  Bottom 0.203: R717.1 64,44.7 v64,44
I2C-CLK  (via drill 0.38)
  Top 0.203: v25.3,45.4 23.8,43.9 21.95,43.9 21.3,43.25 R802.2 v21.3,35.85 20.68,35.23 U1006.5
  Bottom 0.203: U1001.66 33.6,42.92 33.6,45.7 32.65,46.65 26.55,46.65 v25.3,45.4 | U1004.8 v21.3,35.85
I2C-DATA  (via drill 0.38)
  Top 0.203: v20.45,36.35 R801.2 20.45,43 21.8,44.35 23.3,44.35 v25.3,46.35 | U1006.3 17.02,33.58 17.4,33.2 v19.95,33.2
  Bottom 0.203: U1001.67 34.05,43.18 34.05,46.05 33,47.1 26.05,47.1 v25.3,46.35 | U1004.7 20.65,32.75 20.45,32.95 20.45,33.2 | v20.45,36.35 20.45,33.2 | v19.95,33.2 20.45,33.2
ICSP-DETECT  (via drill 0.38)
  Top 0.203: K1006.2 71.2,11.05 R106.2 X1.5 69.3,10.75 67.75,12.3 66.05,12.3 65.65,12.7 63.5,12.7 62.45,11.65 62.45,8.65 61.75,7.95 LED901.2 60.25,7.95 v59.8,8.4
  Bottom 0.203: U1001.28 36.15,25.68 36.15,23.6 50.55,9.2 59,9.2 v59.8,8.4
ICSP-LED  (via drill 0.38)
  Top 0.203: K1007.2 65.05,16.55 61.1,12.6 LED901.1
  Top 0.254: v66.3,17.35 65.75,17.35 K1007.2
  Bottom 0.254: 67.5,16.65 K1008.2 66.85,17.35 v66.3,17.35
ICSP-SSR  (via drill 0.38)
  Top 0.203: K1006.1 C903.1
  other vias: 74.5,11.85
IMP-1  (via drill 0.38)
  Top 0.203: v35.7,48 36.05,48.35 IMP-1&2.3
  Bottom 0.203: U1001.68 34.5,43.44 34.5,46.8 v35.7,48
IMP-2  (via drill 0.38)
  Top 0.203: v36.7,48 IMP-1&2.2
  Bottom 0.203: U1001.69 34.95,43.69 34.95,45.95 36.7,47.7 v36.7,48
IMP-3  (via drill 0.38)
  Top 0.203: v48.15,47.6 IMP-3.3
  Bottom 0.203: U1001.70 35.4,43.95 35.4,45.75 37.65,48 42.55,48 43.35,47.2 47.35,47.2 47.75,47.6 v48.15,47.6
INPUT-V-SENSE
  Top 0.254: R202.2 40.35,20.5 40.11,20.74 R201.2 40.81,22.2 41.55,22.2 F900.1
JTAG-PIN-1
  Bottom 0.203: U1001.17 42.12,29.45 TP1.TP
JTAG-PIN-2
  Bottom 0.203: U1001.38 32.8,29.4 32.8,28.4 31.4,27 TP3.TP
JTAG-PIN-3
  Bottom 0.203: U1001.60 31.3,40.98 TP4.TP
JTAG-PIN-4
  Bottom 0.203: U1001.61 33.45,39.54 TP5.TP
LB-PD  (via drill 0.38)
  Top 0.203: v64.8,44.5 MEM1001.39
  Bottom 0.203: R716.1 64.8,45.4 v64.8,44.5
LOAD-AN6
  Top 0.254: K1007.3 64.3,10.7 64.3,8.6 X1.1
LOAD-AN7
  Bottom 0.254: K1008.3 66.3,10.2 66.3,9.15 67.3,8.15 X1.3
MCLR  (via drill 0.38)
  Top 0.203: R104.2 v43.5,30.9 | v43.5,30.9
  Bottom 0.203: U1001.13 v43.5,30.9
MPL-BYP-CAP
  Bottom 0.254: U1004.2 24.05,32.75 24.35,32.45 C802.2
OE-PD  (via drill 0.38)
  Top 0.203: v63.2,44.5 MEM1001.41
  Bottom 0.203: R718.1 62.7,44.5 v63.2,44.5
OIL-PRESS-OUT  (via drill 0.38)
  Bottom 0.254: R904.1 51.05,14.7 66.8,14.7 68.4,16.3 70.15,16.3 70.9,17.05 AUX.P3
  other vias: 76.3,17.05
OSCI
  Bottom 0.203: U1001.64 32.06,43.05 Y1001.P$3
PMA-LH  (via drill 0.38)
  Top 0.203: v66.9,49 66.7,49.2 v64.65,49.2 | v41.5,47 39.7,45.2 39.7,44.6 38.05,42.95 37.25,42.95 v36.5,42.2 | v35.55,40.8 35.55,39.85 34.4,38.7 34.4,38.35 33.95,37.9 v33.95,36.9 | v33.95,34.1 v33.95,32.45
  Bottom 0.203: U1003.11 66.28,48.38 v66.9,49 | v64.65,49.2 61,49.2 60.45,48.65 60.45,47 58.45,45 58.23,45 arc45 58.09,44.94 57.5,44.35 54.1,44.35 51.95,46.5 49.65,46.5 49.4,46.75 43.2,46.75 42.65,47.3 41.8,47.3 v41.5,47 | v36.5,42.2 35.55,41.25 v35.55,40.8 | v33.95,36.9 v33.95,34.1 | U1001.43 32.31,32.45 v33.95,32.45
PMA-LL  (via drill 0.38)
  Top 0.254: v51.3,28.3 47.5,28.3 47.05,28.75 46.5,28.75 45.55,27.8 41.75,27.8 40.5,29.05 35.45,29.05 32.31,32.19 v32.31,33.15 | v64.9,29.45 66.85,29.45 67.35,29.95 68.3,29.95 69.05,30.7 v71.95,30.7
  Bottom 0.203: U1001.44 v32.31,33.15
  Bottom 0.254: v51.3,28.3 60.4,28.3 60.5,28.4 63.85,28.4 v64.9,29.45 | U1002.11 72.12,30.88 v71.95,30.7
PMD0  (via drill 0.38)
  Top 0.203: v45.25,38.35 R700.1
  Bottom 0.203: U1001.93 45.29,38.35 v45.25,38.35
PMD1
  Bottom 0.203: U1001.94 47.93,40.29 R701.1
PMD2  (via drill 0.38)
  Top 0.203: v47.05,36.55 R702.1
  Bottom 0.203: U1001.98 47.05,36.58 v47.05,36.55
PMD3
  Bottom 0.203: U1001.99 49.66,38.48 R703.1
PMD4  (via drill 0.38)
  Top 0.203: v49.5,37.3 49.5,37.6 R704.1
  Bottom 0.203: U1001.100 49.19,37.3 v49.5,37.3
PMD5
  Bottom 0.203: U1001.3 49.23,32.24 R705.1
PMD6  (via drill 0.38)
  Top 0.203: v46.65,34.1 R706.1
  Bottom 0.203: U1001.4 46.66,34.1 v46.65,34.1
PMD7
  Bottom 0.203: U1001.5 R707.1
PMD8  (via drill 0.38)
  Top 0.203: v44.2,39.4 R708.1
  Bottom 0.203: U1001.90 44.21,39.4 v44.2,39.4
PMD9
  Bottom 0.203: U1001.89 R709.1
PMD10  (via drill 0.38)
  Top 0.203: v43.5,40.1 R710.1
  Bottom 0.203: U1001.88 v43.5,40.1 | v43.5,40.1
PMD11
  Bottom 0.203: U1001.87 R711.1
PMD12  (via drill 0.38)
  Top 0.203: R712.1 42.4,45.86 v42.4,46.6
  Bottom 0.203: v42.4,46.6 42.15,46.35 42.15,45.11 U1001.79
PMD13
  Bottom 0.203: U1001.80 R713.1
PMD14  (via drill 0.38)
  Top 0.203: v41.75,41.85 R714.1
  Bottom 0.203: U1001.83 41.75,41.89 v41.75,41.85
PMD15
  Bottom 0.203: U1001.84 44.35,43.78 R715.1
PMD-0  (via drill 0.38)
  Top 0.203: MEM1001.7 65.6,35.55 | 65.6,35.55 v66.25,36.2 | R700.2 49.19,40.45 52.5,40.45 57.4,35.55 65.6,35.55
  Bottom 0.203: U1002.2 66.92,36.88 v66.25,36.2
PMD-1  (via drill 0.38)
  Top 0.203: MEM1001.8 66.4,35.35 v67.25,36.2 66.55,36.9 65.95,36.9 65.05,36 57.55,36 52.65,40.9 49.95,40.9 v49.2,41.65
  Bottom 0.203: U1002.3 67.58,36.52 v67.25,36.2 | R701.2 v49.2,41.65
PMD-2  (via drill 0.38)
  Top 0.203: MEM1001.9 67.2,35.15 v67.25,35.2 | R702.2 50.5,40 52,40 v56.4,35.6
  Bottom 0.203: U1002.4 68.22,36.17 v67.25,35.2 66.25,35.2 66.15,35.3 56.7,35.3 v56.4,35.6
PMD-3  (via drill 0.38)
  Top 0.203: MEM1001.10 68,34.85 v68.35,35.2
  Bottom 0.203: v68.35,35.2 68.88,35.73 U1002.5 68.88,37.83 68.55,38.15 62.9,38.15 61.95,39.1 61.25,39.1 60.75,38.6 51.04,38.6 R703.2
PMD-4  (via drill 0.38)
  Top 0.203: MEM1001.13 70.4,34.85 v70.05,35.2 | R704.2 51.2,39.3 v51.7,39.3
  Bottom 0.203: v70.05,35.2 69.53,35.73 U1002.6 69.53,37.83 68.75,38.6 63.15,38.6 62.2,39.55 61.05,39.55 60.8,39.3 v51.7,39.3
PMD-5  (via drill 0.38)
  Top 0.203: MEM1001.14 71.2,35.15 v71.15,35.2
  Bottom 0.203: U1002.7 70.17,36.17 v71.15,35.2 70.4,34.45 65.1,34.45 64.75,34.8 54.05,34.8 50.73,31.48 R705.2
PMD-6  (via drill 0.38)
  Top 0.203: MEM1001.15 72,35.35 v71.15,36.2 | R706.2 51.33,31.13 v51.65,31.45
  Bottom 0.203: U1002.8 70.83,36.52 v71.15,36.2 71.9,35.45 71.9,34.95 70.95,34 64.85,34 64.5,34.35 54.55,34.35 v51.65,31.45
PMD-7  (via drill 0.38)
  Top 0.203: MEM1001.16 72.8,35.55 v72.15,36.2
  Bottom 0.203: U1002.9 71.47,36.88 v72.15,36.2 72.35,36 72.35,34.7 71.2,33.55 64.7,33.55 64.35,33.9 55.05,33.9 51.9,30.75 49.3,30.75 R707.2
PMD-8  (via drill 0.38)
  Top 0.203: MEM1001.29 72.8,43.95 v72.15,43.3 71.45,42.6 70,42.6 67.9,40.5 63.85,40.5 63,41.35 58.25,41.35 57.15,42.45 47.25,42.45 R708.2
  Bottom 0.203: U1003.2 71.47,42.62 v72.15,43.3
PMD-9  (via drill 0.38)
  Top 0.203: MEM1001.30 72,44.15 v71.15,43.3
  Bottom 0.203: v71.15,43.3 70.83,42.98 U1003.3 70.83,41.58 69.75,40.5 63.35,40.5 60.2,43.65 58.65,43.65 58,43 47.1,43 R709.2
PMD-10  (via drill 0.38)
  Top 0.203: MEM1001.31 v71.2,44.4 67.75,40.95 64.05,40.95 63.2,41.8 58.4,41.8 57.3,42.9 47.8,42.9 47.55,43.15 46.55,43.15 R710.2
  Bottom 0.203: U1003.4 70.17,43.33 71.2,44.35 v71.2,44.4
PMD-11  (via drill 0.38)
  Top 0.203: MEM1001.32 70.4,44.6 v70.2,44.4
  Bottom 0.203: v70.2,44.4 70.2,44.15 69.53,43.48 U1003.5 69.53,41.77 68.7,40.95 63.55,40.95 60.4,44.1 58.45,44.1 57.8,43.45 47.25,43.45 47.2,43.5 46.2,43.5 R711.2
PMD-12  (via drill 0.38)
  Top 0.203: R712.2 43.75,46.75 45.25,46.75 47.25,44.75 47.75,44.75 48.25,44.25 57.85,44.25 60.35,46.75 67.2,46.75 68,45.95 MEM1001.35 68,44.6 v68.2,44.4
  Bottom 0.203: U1003.6 68.88,43.48 68.2,44.15 v68.2,44.4
PMD-13  (via drill 0.38)
  Top 0.203: v67.2,44.4 MEM1001.36 67.2,45.8 66.75,46.25 60.45,46.25 58,43.8 48.1,43.8 47.6,44.3 46.7,44.3 v44.95,46.05
  Bottom 0.203: U1003.7 68.22,43.33 67.2,44.35 v67.2,44.4 | v44.95,46.05 43.8,46.05 arc90 R713.2
PMD-14  (via drill 0.38)
  Top 0.203: MEM1001.37 66.4,44.2 v67.25,43.35 66.25,42.35 63.45,42.35 63.35,42.25 58.55,42.25 57.45,43.35 47.95,43.35 47.45,43.85 45.79,43.85 R714.2
  Bottom 0.203: U1003.8 67.58,43.02 v67.25,43.35
PMD-15  (via drill 0.38)
  Top 0.203: MEM1001.38 65.6,44 v66.25,43.35 65.7,42.8 62.65,42.8 v61.95,43.5
  Bottom 0.203: U1003.9 66.92,42.67 v66.25,43.35 | v61.95,43.5 60.9,44.55 58.3,44.55 57.65,43.9 47.6,43.9 47.25,44.25 45.39,44.25 R715.2
PMP-CS1  (via drill 0.38)
  Top 0.203: MEM1001.6 64.8,34.65 64.55,34.9 56.1,34.9 v55.4,35.6 | v50.8,33.9 50.5,33.9 49.55,34.85 46.55,34.85 39.4,42 38.46,42 v38.26,41.8 | v73.9,41.2 73.9,38.8 72.95,37.85 72.4,37.85 72.15,38.1 65.1,38.1 v64.4,37.4
  Bottom 0.203: v50.8,33.9 52.1,33.9 53.8,35.6 v55.4,35.6 56.1,36.3 56.7,36.3 57.25,35.75 64.67,35.75 U1002.1 64.45,37.35 v64.4,37.4 | v38.26,41.8 U1001.71 | U1003.1 72.9,42.2 v73.9,41.2
PMP-READ
  Bottom 0.203: U1001.82 44.46,45.3 45.4,45.3 45.5,45.4 R719.1
PMP-WRITE  (via drill 0.38)
  Top 0.203: v61.6,38.35 61.8,38.55 v72.7,38.55 | v73.6,36 MEM1001.17 | v50.1,35.3 46.7,35.3 40.85,41.15 v40.85,42.4
  Bottom 0.203: v61.6,38.35 61.4,38.15 52.95,38.15 v50.1,35.3 | v73.6,36 73.6,37.65 v72.7,38.55 | U1001.81 v40.85,42.4 | v40.85,42.4
PWM1-WARN  (via drill 0.38)
  Top 0.203: v38.9,46.6 38.5,46.6 38.25,46.85 28.4,46.85 23.8,42.25 v22.2,42.25
  Bottom 0.203: U1001.77 40.95,45.33 40.95,45.85 40.2,46.6 v38.9,46.6 | v22.2,42.25 17.95,42.25 17.5,41.8 16.8,41.8 16.75,41.85 DISP-1.3
PWM2-WARN  (via drill 0.38)
  Top 0.203: v38.2,45.9 37.7,46.4 28.55,46.4 23.65,41.5 v22.8,41.5 | v17.05,40.75 14.8,38.5 v14.8,36.7
  Bottom 0.203: U1001.76 39.46,45.9 v38.2,45.9 | v22.8,41.5 17.8,41.5 v17.05,40.75 | v14.8,36.7 14.6,36.7 11,33.1 11,31.7 11.6,31.1 11.6,29.2 11.25,28.85 DISP-2.3
PWM3-WARN  (via drill 0.38)
  Top 0.203: v22.1,40.8 23.55,40.8 28.7,45.95 35.6,45.95 v36.15,45.4 | v18.6,40.8 v18.6,36.9 | v14.25,22.25 14.25,28.95 v14.9,29.6
  Bottom 0.203: DISP-3.3 11.85,15.85 14.25,18.25 v14.25,22.25 | v22.1,40.8 v18.6,40.8 | v14.9,29.6 16.1,30.8 16.1,32.2 18.6,34.7 v18.6,36.9 | U1001.72 36.15,44.61 v36.15,45.4
PWM-BL  (via drill 0.38)
  Top 0.254: DISP-1.16 DISP-1.6 | DISP-2.16 DISP-2.6 | DISP-3.6 DISP-3.16 | v22.2,43.2 24.1,43.2 28.2,47.3 v39.55,47.3
  Bottom 0.203: U1001.78 41.4,45.07
  Bottom 0.254: 41.4,45.07 41.4,46.1 40.2,47.3 v39.55,47.3 | DISP-1.6 6.66,41.45 7.55,41.45 9.3,43.2 v22.2,43.2 | DISP-1.16 6.66,38.05 7.4,38.05 9.05,36.4 9.05,30.1 7.4,28.45 6.66,28.45 DISP-2.6 | DISP-2.16 6.66,25.05 7.4,25.05 9.05,23.4 9.05,17.1 7.4,15.45 6.66,15.45 DISP-3.6
SD-CARD-DETECT  (via drill 0.38)
  Top 0.203: v78.35,38.95 v78.35,40.55 | v64,49.9 v67.2,49.9 | X3.9 R805.2
  Bottom 0.203: U1001.59 31.57,40 27.35,40 24.6,42.75 24.6,46.65 25.55,47.6 34.3,47.6 36.65,49.95 41.2,49.95 43.5,47.65 47.2,47.65 47.9,48.35 48.4,48.35 49.8,46.95 52.1,46.95 54.25,44.8 57.3,44.8 57.84,45.34 arc-45 57.98,45.4 58.12,45.4 arc45 58.26,45.46 60,47.2 60,48.63 arc-45 60.12,48.92 61.1,49.9 v64,49.9 | v78.35,38.95 78.35,36 79.9,34.45 81.65,34.45 84,32.1 84,28.65 X3.9 | v78.35,40.55 78.35,45.7 78.7,46.05 78.7,47.7 76.35,50.05 67.35,50.05 v67.2,49.9
SD-SPI-CLK  (via drill 0.38)
  Top 0.203: v51.45,34.6 57.45,28.6 60.7,28.6 v62.5,26.8
  Bottom 0.203: U1001.97 47.01,37.25 46.65,37.25 46.3,36.9 46.3,36.35 47.55,35.1 49,35.1 49.5,34.6 v51.45,34.6 | v62.5,26.8 64.75,24.55 77.12,24.55 78.33,25.75 X3.3
SD-SPI-DI  (via drill 0.38)
  Top 0.203: v46.45,40.55 44.5,38.6 44.5,38.15 46.8,35.85 49.7,35.85 49.85,36 51,36 52.15,34.85 52.15,34.5 57.6,29.05 60.85,29.05 61.85,28.05 67.65,28.05 68.3,28.7 69.5,28.7 70.2,29.4 76.7,29.4 77.05,29.75 X3.5
  Bottom 0.203: U1001.92 46.45,40.22 v46.45,40.55
SD-SPI-DO  (via drill 0.38)
  Top 0.203: v51.4,33.1 52.35,33.1 57.3,28.15 60.05,28.15 v61.4,26.8
  Bottom 0.203: U1001.1 49.78,33.1 v51.4,33.1 | v61.4,26.8 62.1,26.1 62.6,26.1 64.6,24.1 77.1,24.1 79.45,21.75 X3.1
SD-WRITE-PROTECT  (via drill 0.38)
  Top 0.203: v39.1,41.3 39.5,41.3 45.25,35.55 45.25,33.05 48.6,29.7 v49.9,29.7 | v54.25,30.2 54.65,30.2 57.15,27.7 59.55,27.7 61.15,26.1 62.75,26.1 64.25,27.6 67.8,27.6 68.45,28.25 69.65,28.25 70.35,28.95 76.7,28.95 80.9,24.75 82.1,24.75 X3.11 R806.2
  Bottom 0.203: U1001.74 37.78,44.4 38.45,44.4 39.1,43.75 v39.1,41.3 | v49.9,29.7 50.3,29.7 50.8,30.2 v54.25,30.2
SENSOR-AN4  (via drill 0.38)
  Top 0.254: v39.25,19.55 v39.25,22.95
  Bottom 0.203: 40.69,28.05 U1001.21
  Bottom 0.254: v39.25,19.55 39.25,18.5 40.65,17.1 40.65,11.05 45,6.7 45,5.8 F904.1 | v39.25,22.95 39.25,27.55 39.75,28.05 40.69,28.05
SENSOR-AN5  (via drill 0.38)
  Top 0.254: v41.15,21.3 v41.15,17.6
  Bottom 0.203: U1001.20 42.75,26.7
  Bottom 0.254: v41.15,21.3 41.15,23 43.5,25.35 43.5,25.95 42.75,26.7 | F905.1 41.15,11.25 v41.15,17.6
SENSOR-AN6  (via drill 0.38)
  Top 0.254: v63.35,11.6 64,12.25 65.4,12.25 66.2,11.45 K1007.4 68.35,10.65 68.35,9.1 69.3,8.15 X1.4
  Bottom 0.203: U1001.26 37.15,25.27
  Bottom 0.254: 37.15,25.27 37.15,23.95 50.7,10.4 62.15,10.4 v63.35,11.6
SENSOR-AN7
  Bottom 0.203: U1001.27 36.65,25.47 36.65,23.8
  Bottom 0.254: K1008.4 64.35,10.75 | 36.65,23.8 50.55,9.9 62.35,9.9 63.2,10.75 64.35,10.75 | 64.35,10.75 64.35,9.3 65.3,8.35 X1.2
SENSOR-AN8
  Bottom 0.203: 33.25,25.61 U1001.32
  Bottom 0.254: F908.2 38.1,7.2 37.7,7.6 36.5,7.6 33.25,10.85 33.25,25.61
SENSOR-AN9
  Bottom 0.203: U1001.33 32.7,25.76
  Bottom 0.254: 32.7,25.76 32.7,10.65 36.85,6.5 F909.2
SENSOR-AN10
  Bottom 0.203: U1001.34 33.15,26.92 33.15,26.9
  Bottom 0.254: 34.89,28.64 U1001.34 | F910.2 32.15,5.65 32.15,25.9 33.15,26.9
SENSOR-AN11
  Bottom 0.203: U1001.35 32.77,27.25 32.75,27.25
  Bottom 0.254: F911.2 29.6,9.5 31.6,11.5 31.6,26.1 32.75,27.25
SENSOR-AN12
  Bottom 0.203: U1001.41 30.6,29.32 30.6,29.2
  Bottom 0.254: F912.2 24.15,5.65 24.15,10.25 26,12.1 30,12.1 31.1,13.2 31.1,24.6 29.1,26.6 29.1,27.7 30.6,29.2
SENSOR-AN13
  Bottom 0.203: U1001.42 30.27,29.7 30.1,29.7
  Bottom 0.254: F913.2 21.6,9.5 24.8,12.7 29.8,12.7 30.6,13.5 30.6,24.3 28.5,26.4 28.5,28.1 30.1,29.7
SGND-1
  pour Top (rank 4): 50.1,2.4 50.1,6.6 46.7,10 44.9,10 arc90 43.9,9 43.9,2.4 arc90 44.9,1.4 49.1,1.4 arc90
  pour Bottom (rank 4): 50.1,2.4 50.1,8.2 46.8,11.5 41.3,11.5 43.9,8.9 43.9,2.4 arc90 44.9,1.4 49.1,1.4 arc90
SGND-3
  pour Top (rank 4): 42.35,10 37.25,10 arc90 36.25,9 36.25,2.4 arc90 37.25,1.4 42.35,1.4 arc90 43.35,2.4 43.35,9 arc90
  pour Bottom (rank 4): 43.35,2.4 43.35,7.65 41,10 37.25,10 arc90 36.25,9 36.25,2.4 arc90 37.25,1.4 42.35,1.4 arc90
SGND-4
  pour Top (rank 4): 34.7,10 29.3,10 arc90 28.3,9 28.3,2.4 arc90 29.3,1.4 34.7,1.4 arc90 35.7,2.4 35.7,9 arc90
  pour Bottom (rank 4): 35.7,2.4 35.7,11.1 28.3,11.1 28.3,2.4 arc90 29.3,1.4 34.7,1.4 arc90
SGND-5
  pour Bottom (rank 4): 27.8,2.4 27.8,11.1 26.6,11.1 25.5,10 21.5,10 arc90 20.5,9 20.5,2.4 arc90 21.5,1.4 26.8,1.4 arc90
  pour Top (rank 4): 26.8,10 21.5,10 arc90 20.5,9 20.5,2.4 arc90 21.5,1.4 26.8,1.4 arc90 27.8,2.4 27.8,9 arc90
SGND-6
  Top 0.508: IMP-1&2.T0 34.75,51.2
  Bottom 0.508: IMP-1&2.T0 34.75,51.2
  pour Top (rank 4): 32.7,52.5 30.6,50.4 30.6,47.5 40.4,47.5 40.4,49.7 37.6,52.5
  pour Bottom (rank 4): 32.7,52.5 30.6,50.4 30.6,47.5 40.4,47.5 40.4,49.7 37.6,52.5
SGND-7
  Bottom 0.508: IMP-3.T0 46.7,51.2
  pour Top: 43.8,48.1 43.8,50 46.3,52.5 50,52.5 52.5,50 52.5,48.1
  pour Bottom: 43.8,48.1 43.8,50 45.5,51.7 45.5,52.2 45.65,52.35 46.15,52.35 46.3,52.5 50,52.5 52.5,50 52.5,48.1
SHIFT-CS-LINE  (via drill 0.38)
  Top 0.203: U1008.-PL 10.6,20 10.5,19.9 v10.5,19.4 | v45.95,33.4 48.95,30.4 50.25,30.4 52,28.65 52,24.6 48.2,20.8 48.2,18.25 43.5,13.55 21.1,13.55 18.7,11.15 18.2,11.15 13.15,16.2 v13.15,18.1
  Bottom 0.203: v45.95,33.4 | v45.95,33.4 U1001.6 | v13.15,18.1 11.8,18.1 v10.5,19.4
SPI1-CLK  (via drill 0.38)
  Top 0.203: v26.5,34.05 27.65,34.05 27.9,34.3 v30.9,34.3
  Bottom 0.203: U1001.48 30.63,34.3 v30.9,34.3 | v26.5,34.05 26.5,34.7 22.8,38.4 14.2,38.4 13.95,38.15 13.5,38.15 13.4,38.25 DISP-1.15
SPI1-DO
  Bottom 0.203: U1001.53 29.28,38.05 26.55,38.05 24.55,40.05 DISP-1.9
SPI2-CLK  (via drill 0.38)
  Top 0.203: v32.1,28.7 31.4,28 27.25,28 v26,26.75
  Bottom 0.203: U1001.39 32.1,29.41 v32.1,28.7 | DISP-2.15 24.5,25.25 v26,26.75
SPI2-DO  (via drill 0.38)
  Top 0.203: v28.2,33.6 v22,27.4
  Bottom 0.203: U1001.50 28.52,33.6 v28.2,33.6 | DISP-2.9 21.65,27.05 v22,27.4
SPI3-CLK  (via drill 0.38)
  Top 0.203: v47,18.7 47,18.4 43.05,14.45 20.05,14.45 v18.45,12.85 | U1008.CP 11.45,18.75 v10.2,17.5
  Bottom 0.203: U1001.10 47.3,29.22 47.3,19 v47,18.7 | v18.45,12.85 17.85,12.25 14.45,12.25 14.35,12.15 13.85,12.15 13.75,12.25 DISP-3.15 9.75,12.25 9.3,12.7 9.3,16.6 v10.2,17.5
SPI3-DO  (via drill 0.38)
  Top 0.203: v46.1,20.4 45.8,20.1 45.8,18.4 42.75,15.35 19.05,15.35 v18.45,14.75 15.9,17.3 15.9,20.1 14.6,21.4 U1008.DS
  Bottom 0.203: U1001.12 46.4,28.71 46.4,20.7 v46.1,20.4 | DISP-3.9 15.6,14.05 15.7,13.95 16.2,13.95 16.3,14.05 17.75,14.05 v18.45,14.75
SRAM-0  (via drill 0.38)
  Top 0.203: MEM1001.1 60.8,32.95 62.9,30.85 v63.5,30.85
  Bottom 0.203: v63.5,30.85 66.6,30.85 66.92,31.18 U1002.19
SRAM-1  (via drill 0.38)
  Top 0.203: MEM1001.2 61.6,32.75 62.8,31.55 63.85,31.55 64.95,30.45 66.25,30.45 v66.55,30.15
  Bottom 0.203: U1002.18 67.58,31.18 v66.55,30.15
SRAM-2  (via drill 0.38)
  Top 0.203: MEM1001.3 62.4,32.55 62.95,32 64.1,32 65.2,30.9 67.75,30.9 v68,30.65
  Bottom 0.203: v68,30.65 68.22,30.88 U1002.17
SRAM-3  (via drill 0.38)
  Top 0.203: MEM1001.4 v63.2,32.7
  Bottom 0.203: v63.2,32.7 63.4,32.5 68.55,32.5 68.88,32.17 U1002.16
SRAM-4  (via drill 0.38)
  Top 0.203: MEM1001.5 v64,33.2
  Bottom 0.203: v64,33.2 64.15,33.05 68.75,33.05 69.53,32.27 U1002.15
SRAM-5  (via drill 0.38)
  Top 0.203: MEM1001.18 74.4,33.55 74.1,33.25 70.9,33.25 v70.5,32.85
  Bottom 0.203: v70.5,32.85 70.17,32.52 U1002.14
SRAM-6  (via drill 0.38)
  Top 0.203: v74.1,32.55 75.2,33.65 MEM1001.19
  Bottom 0.203: U1002.13 70.85,31.68 70.85,32.2 71.5,32.85 73.8,32.85 v74.1,32.55
SRAM-7  (via drill 0.38)
  Top 0.203: v75.55,33 76,33.45 MEM1001.20
  Bottom 0.203: U1002.12 71.47,32.17 71.7,32.4 73.05,32.4 73.6,31.85 74.4,31.85 v75.55,33
SRAM-8  (via drill 0.38)
  Top 0.203: v76.75,35.3 76.75,34.1 MEM1001.21
  Bottom 0.203: U1003.19 71.47,48.38 71.8,48.7 73.45,48.7 76.75,45.4 v76.75,35.3
SRAM-9  (via drill 0.38)
  Top 0.203: v76.05,37.1 77.6,35.55 MEM1001.22
  Bottom 0.203: U1003.18 70.83,47.33 71.05,47.1 73.15,47.1 73.25,47.2 74.25,47.2 76.05,45.4 v76.05,37.1
SRAM-10  (via drill 0.38)
  Top 0.203: v77.35,46.6 77.6,46.35 MEM1001.23
  Bottom 0.203: U1003.17 70.17,48.42 70.9,49.15 73.7,49.15 76.25,46.6 v77.35,46.6
SRAM-11  (via drill 0.38)
  Top 0.203: v76.45,47.45 76.45,46.5 76.8,46.15 MEM1001.24
  Bottom 0.203: U1003.16 69.53,48.48 70.65,49.6 74.3,49.6 v76.45,47.45
SRAM-12  (via drill 0.38)
  Top 0.203: v73.95,46.5 75.45,46.5 76,45.95 MEM1001.25
  Bottom 0.203: U1003.15 68.88,47.38 69.6,46.65 73.8,46.65 v73.95,46.5
SRAM-13  (via drill 0.38)
  Top 0.203: v75.05,44.3 75.2,44.45 MEM1001.26
  Bottom 0.203: U1003.14 68.22,47.33 69.35,46.2 73.15,46.2 v75.05,44.3
SRAM-14  (via drill 0.38)
  Top 0.203: v74.05,44.3 74.4,44.65 MEM1001.27
  Bottom 0.203: U1003.13 67.58,47.38 69.25,45.7 72.65,45.7 v74.05,44.3
SRAM-15  (via drill 0.38)
  Top 0.203: MEM1001.42 62.4,44.3 63.4,43.3 64.6,43.3 v64.8,43.5
  Bottom 0.203: U1003.12 66.92,47.33 65.5,45.9 65.5,44.2 v64.8,43.5
SRAM-16  (via drill 0.38)
  Top 0.203: v48.4,39 47.35,39 v46,37.65 | MEM1001.43 61.6,44.6 v59.95,42.95
  Bottom 0.203: v59.95,42.95 59.1,42.1 51.6,42.1 48.5,39 v48.4,39 | v46,37.65 | v46,37.65 U1001.95
SRAM-17  (via drill 0.38)
  Top 0.203: MEM1001.44 60.8,44.85 v58.9,42.95
  Bottom 0.203: v58.9,42.95 58.5,42.55 51.35,42.55 48.5,39.7 48.15,39.7 47.7,39.25 47.7,38.64 U1001.96
SRST-MCLR  (via drill 0.38)
  Top 0.203: R103.2 46.9,26 46.9,24.4 47.7,23.6 48.8,23.6 TP2.TP | v49.1,18.4 v49.1,20.7 | K1006.3 v68.5,15.15
  Top 0.305: R104.1 R103.2
  Bottom 0.203: v68.5,15.15 67.9,15.15 67,14.25 50.3,14.25 49.15,15.4 49.15,16 48.25,16.9 48.25,17.5 49.1,18.35 v49.1,18.4 | TP2.TP 49.1,23.9 v49.1,20.7
STATUS  (via drill 0.38)
  Top 0.203: R101.1 34.5,40.5 v34.85,40.15
  Bottom 0.203: v34.85,40.15 34.25,40.15 U1001.63
STATUS-LED
  Top 0.203: LED101.1 30.85,39.3 R101.2
USB-PIN-1  (via drill 0.38)
  Top 0.203: v21.2,46.65 21.2,48.45 21.95,49.2 23,49.2 USB.1
  Bottom 0.203: U1001.54 29.49,38.55 26.8,38.55 22.9,42.45 22.9,43.7 21.2,45.4 v21.2,46.65
USB-PIN-2
  Bottom 0.203: U1001.56 30.45,39 27.1,39 23.7,42.4 USB.2
USB-PIN-3
  Bottom 0.203: U1001.57 30.71,39.45 27.25,39.45 24.15,42.55 24.15,47.05 24.6,47.5 24.6,49 USB.3
USB-PWR  (via drill 0.38)
  Top 0.254: P-12&13.1 23.85,4.4 24.1,4.15 24.1,1.2 | P-10&11.1 31.85,4.4 32.1,4.15 32.1,1.3 | P-8&9.1 38.45,4.4 38,3.95 38,1.3 | 47.3,4.4 48,3.7 48,1.3
  Top 0.305: 47.3,4.4 P-4&5.1 | K1003.3 36,10.9 | K1004.4 36,10.9 | 24.1,1.2 24.3,1 31.8,1 | 32.4,1 32.1,1.3 31.8,1 | 37.7,1 38,1.3 38.3,1 | 37.7,1 36.4,1 | 36.4,1 36,1 | 36,1 35.6,1 | 35.6,1 32.4,1 | 36,10.9 36,1.4 | 36,1.4 36,1 | 47.7,1 38.3,1 | 47.7,1 48,1.3 48.3,1 | 31.8,1 32.4,1 | 37.7,1 38.3,1 | 36,1.4 36.4,1 | 36,1.4 35.6,1 | 48.3,1 47.7,1 | 48.3,1 49.75,1 50.55,1.8 50.55,6.55 v56.05,12.05
  Bottom 0.305: K1005.4 68.1,13.15 62.4,13.15 61.3,12.05 v56.05,12.05
USB-SSR
  Top 0.254: K1003.2 K1004.1 34.6,17 34.3,17.3 C902.2
USB-V-TOGGLE  (via drill 0.38)
  Bottom 0.203: U1001.29 35.7,25.94 35.7,23.45 38.4,20.75 R907.1
  other vias: 38.4,18.25
V-CAP  (via drill 0.38)
  Top 0.203: v44.45,42.8 44,42.8 C102.1
  Bottom 0.203: U1001.85 44.08,42.8 v44.45,42.8

## Text on the board
tStop: D-DAQ | Created By / M.O'B | CERN / OHL v1.2